# EAGLE design Sensor_EV76C560 (EAGLE 9.6.2)
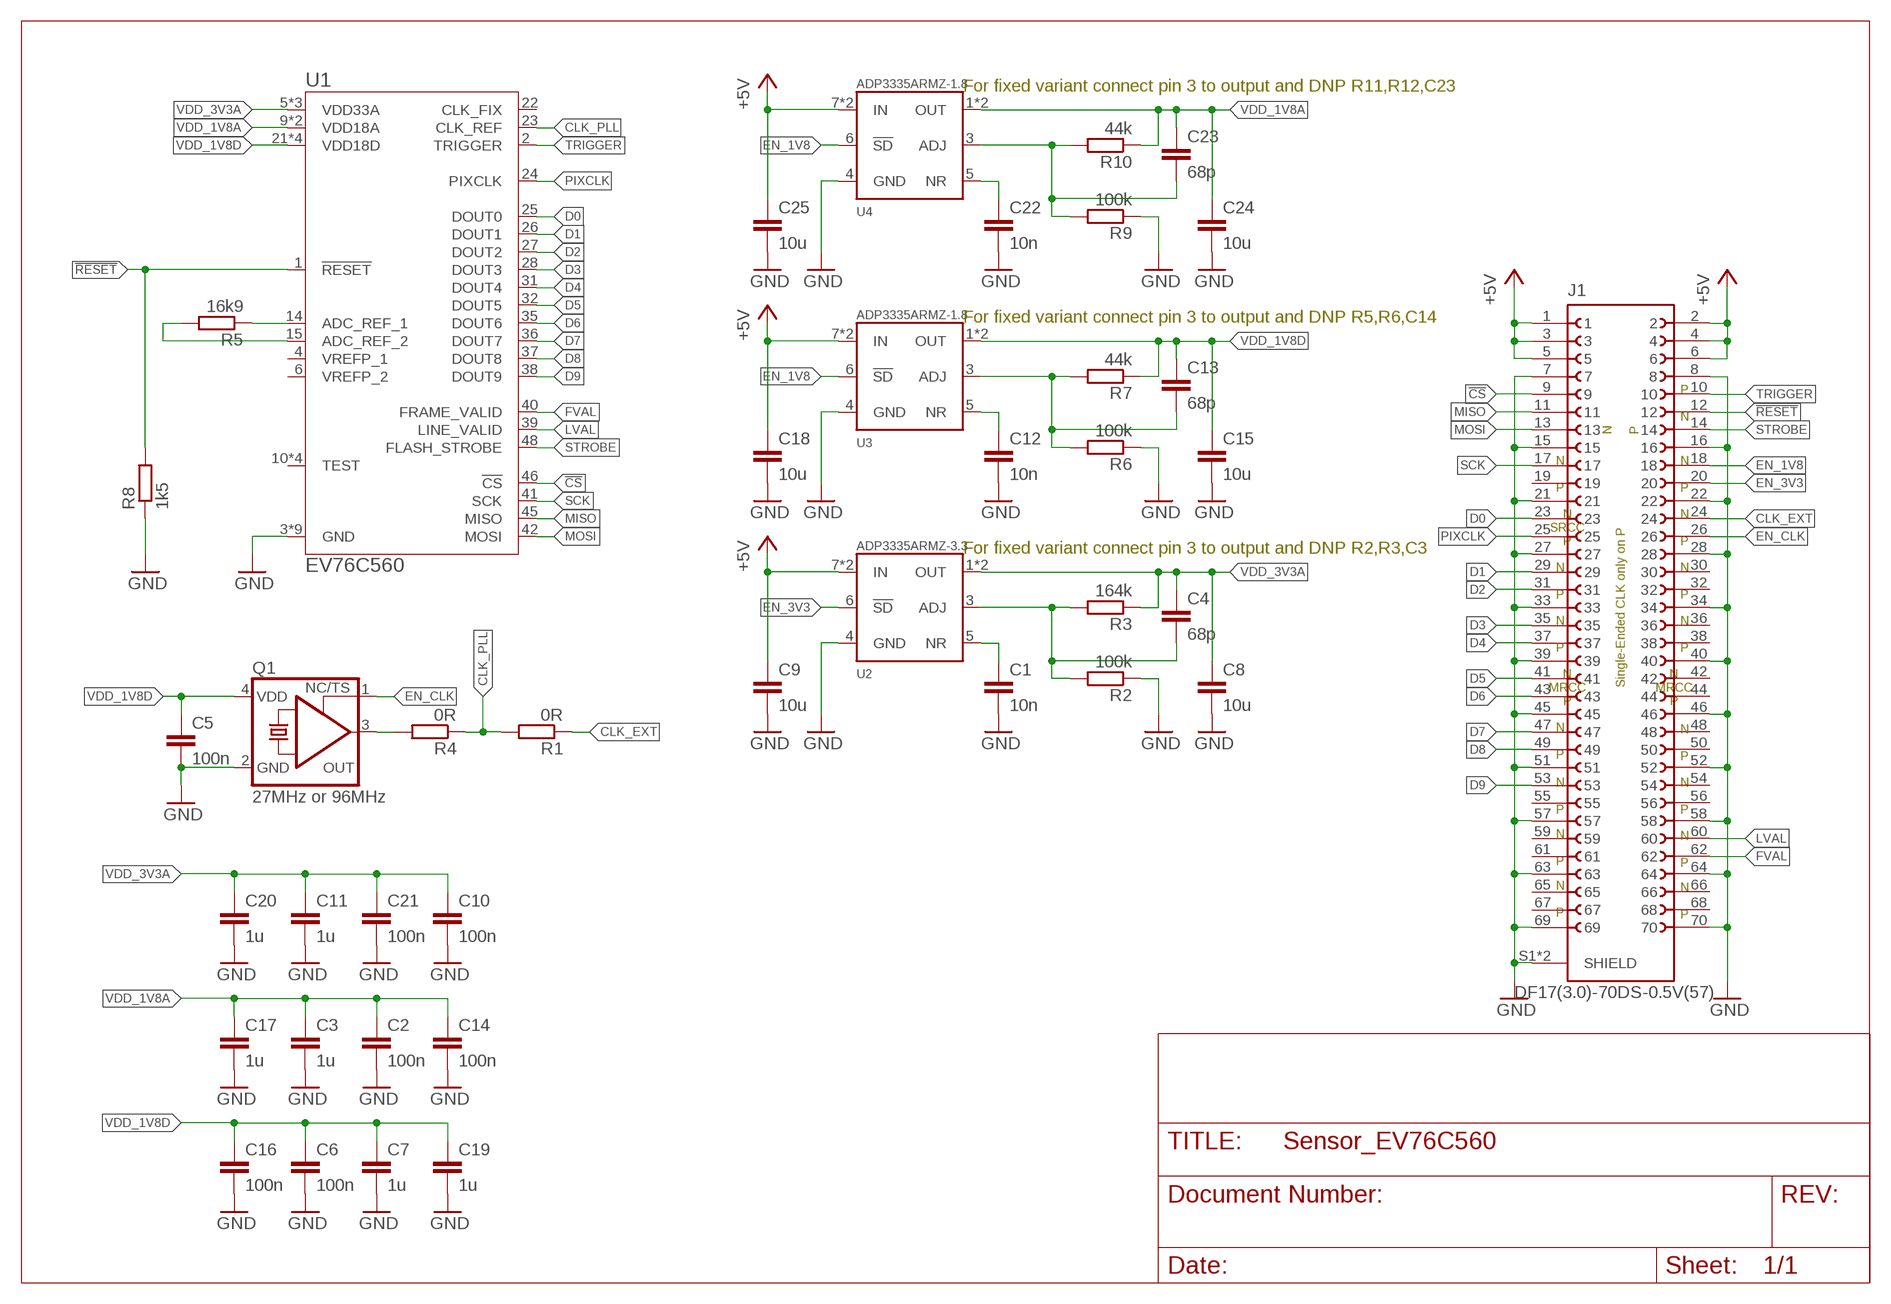
[diagram p0: schematic, sheet 1]

## Parts
C1  10n  C-EUC0402  [C0402]
C2  100n  C-EUC0402  [C0402]
C3  1u  C-EUC0402  [C0402]
C4  68p  C-EUC0402  [C0402]
C5  100n  C-EUC0402  [C0402]
C6  100n  C-EUC0402  [C0402]
C7  1u  C-EUC0402  [C0402]
C8  10u  C-EUC0603  [C0603]
C9  10u  C-EUC0603  [C0603]
C10  100n  C-EUC0402  [C0402]
C11  1u  C-EUC0402  [C0402]
C12  10n  C-EUC0402  [C0402]
C13  68p  C-EUC0402  [C0402]
C14  100n  C-EUC0402  [C0402]
C15  10u  C-EUC0603  [C0603]
C16  100n  C-EUC0402  [C0402]
C17  1u  C-EUC0402  [C0402]
C18  10u  C-EUC0603  [C0603]
C19  1u  C-EUC0402  [C0402]
C20  1u  C-EUC0402  [C0402]
C21  100n  C-EUC0402  [C0402]
C22  10n  C-EUC0402  [C0402]
C23  68p  C-EUC0402  [C0402]
C24  10u  C-EUC0603  [C0603]
C25  10u  C-EUC0603  [C0603]
J1  DF17(3.0)-70DS-0.5V(57)  [DF17(3.0)-70DS-0.5V(57)]
Q1  27MHz or 96MHz  KXO-PXO/XO-V96  [3.2X2.5_KXO-V96]
R1  0R  R-EU_R0402  [R0402]
R2  100k  R-EU_R0402  [R0402]
R3  164k  R-EU_R0402  [R0402]
R4  0R  R-EU_R0402  [R0402]
R5  16k9  R-EU_R0402  [R0402]
R6  100k  R-EU_R0402  [R0402]
R7  44k  R-EU_R0402  [R0402]
R8  1k5  R-EU_R0402  [R0402]
R9  100k  R-EU_R0402  [R0402]
R10  44k  R-EU_R0402  [R0402]
U1  EV76C560  [LCC-48]
U2  ADP3335ARMZ-3.3  NCP3335  [MSOP08]
U3  ADP3335ARMZ-1.8  NCP3335  [MSOP08]
U4  ADP3335ARMZ-1.8  NCP3335  [MSOP08]

## Nets
!CS: J1.9 U1.46(!CS)
!RESET: J1.12 R8.2 U1.1(!RESET)
+5V: C9.1 C18.1 C25.1 J1.1 J1.2 J1.3 J1.4 J1.5 J1.6 U2.7(IN) U2.8(IN) U3.7(IN) U3.8(IN) U4.7(IN) U4.8(IN)
CLK: Q1.3(OUT) R4.2
CLK_EXT: J1.24 R1.1
CLK_PLL: R1.2 R4.1 U1.23(CLK_REF)
D0: J1.23 U1.25(DOUT0)
D1: J1.29 U1.26(DOUT1)
D2: J1.31 U1.27(DOUT2)
D3: J1.35 U1.28(DOUT3)
D4: J1.37 U1.31(DOUT4)
D5: J1.41 U1.32(DOUT5)
D6: J1.43 U1.35(DOUT6)
D7: J1.47 U1.36(DOUT7)
D8: J1.49 U1.37(DOUT8)
D9: J1.53 U1.38(DOUT9)
EN_1V8: J1.18 U3.6(!SD) U4.6(!SD)
EN_3V3: J1.20 U2.6(!SD)
EN_CLK: J1.26 Q1.1(TS)
FVAL: J1.62 U1.40(FRAME_VALID)
GND: C1.2 C2.2 C3.2 C5.2 C6.2 C7.2 C8.2 C9.2 C10.2 C11.2 C12.2 C14.2 C15.2 C16.2 C17.2 C18.2 C19.2 C20.2 C21.2 C22.2 C24.2 C25.2 J1.7 J1.8 J1.15 J1.16 J1.21 J1.22 J1.27 J1.28 J1.33 J1.34 J1.39 J1.40 J1.45 J1.46 J1.51 J1.52 J1.57 J1.58 J1.63 J1.64 J1.69 J1.70 J1.S1(SHIELD) J1.S2(SHIELD) Q1.2(GND) R2.1 R6.1 R8.1 R9.1 U1.3(GND) U1.7(GND) U1.13(GND) U1.16(GND) U1.19(GND) U1.20(GND) U1.29(GND) U1.33(GND) U1.43(GND) U2.4(GND) U3.4(GND) U4.4(GND)
LVAL: J1.60 U1.39(LINE_VALID)
MISO: J1.11 U1.45(MISO)
MOSI: J1.13 U1.42(MOSI)
N$00002: C1.1 U2.5(NR)
N$00003: C22.1 U4.5(NR)
N$00004: C12.1 U3.5(NR)
N$00005: C23.2 R9.2 R10.2 U4.3(ADJ)
N$00006: C13.2 R6.2 R7.2 U3.3(ADJ)
N$00007: R5.1 U1.14(ADC_REF_1)
N$00008: R5.2 U1.15(ADC_REF_2)
N$00010: C4.2 R2.2 R3.2 U2.3(ADJ)
PIXCLK: J1.25 U1.24(PIXCLK)
SCK: J1.17 U1.41(SCK)
STROBE: J1.14 U1.48(FLASH_STROBE)
TRIGGER: J1.10 U1.2(TRIGGER)
VDD_1V8A: C2.1 C3.1 C14.1 C17.1 C23.1 C24.1 R10.1 U1.9(VDD18A) U1.18(VDD18A) U4.1(OUT) U4.2(OUT)
VDD_1V8D: C5.1 C6.1 C7.1 C13.1 C15.1 C16.1 C19.1 Q1.4(VDD) R7.1 U1.21(VDD18D) U1.30(VDD18D) U1.34(VDD18D) U1.44(VDD18D) U3.1(OUT) U3.2(OUT)
VDD_3V3A: C4.1 C8.1 C10.1 C11.1 C20.1 C21.1 R3.1 U1.5(VDD33A) U1.8(VDD33A) U1.17(VDD33A) U2.1(OUT) U2.2(OUT)
Unconnected: J1.19 J1.30 J1.32 J1.36 J1.38 J1.42 J1.44 J1.48 J1.50 J1.54 J1.55 J1.56 J1.59 J1.61 J1.65 J1.66 J1.67 J1.68 U1.4(VREFP_1) U1.6(VREFP_2) U1.10(TEST) U1.11(TEST) U1.12(TEST) U1.22(CLK_FIX) U1.47(TEST)

## Notes on the sheet
- For fixed variant connect pin 3 to output and DNP R11,R12,C23
- For fixed variant connect pin 3 to output and DNP R5,R6,C14
- P
   
  N
- N
   
  P
- N
   
  P
- N
   
  P
- N
  SRCC
  P
- N
   
  P
- For fixed variant connect pin 3 to output and DNP R2,R3,C3
- N
   
  P
- N
   
  P
- Single-Ended CLK only on P
- N
   
  P
- N
   
  P
- N
  MRCC
  P
- N
  MRCC
  P
- N
   
  P
- N
   
  P
- N
   
  P
- N
   
  P
- N
   
  P
- N
   
  P
- N
   
  P
- N
   
  P

## Library data of the parts
C1 C2 C4 C6 C10 C12-C14 C16 C21-C23 = rcl:C-EU: CAPACITOR, European symbol; LCSC: C1525; SPICEPREFIX: C
C3 C7-C9 C11 C15 C17-C20 C24 C25 = rcl:C-EU: CAPACITOR, European symbol; SPICEPREFIX: C
C5 = rcl:C-EU: CAPACITOR, European symbol; LCSC: C1525
J1 = Hirose:DF17(3.0)-70DS-0.5V(57)
Q1 = crystal-geyer_V1_0:KXO-PXO/XO-V: Clock Oscillator (PXO/XO) MHz : KXO-V - Serie Model Size l/w/h [mm] Frequency Range Frequency Stability Temp. Range [°C] Output AECQ 200 availabel Datasheet KXO-V94 KXO-V94 KXO-V95 KXO-V95 KXO-V96 KXO-V96 KXO-V99 KXO-V99 KXO-97 KXO-V97 KXO-97 - KXO-V97 2.0/1.6/0.80 2.0/1.6/0.80 2.5/2.0/0.82 2.5/2.0/0.82 3.2/2.5/1.2 3.2/2.5/1.2 5.0/3.2/1.2 5.0/3.2/1.2 7.0/5.08/1.3 7.0/5.08/1.3 7.0/5.08/1.3 32,768 kHz 1,0 ~ 80,0 MHz 32,768 kHz 1,0 ~ 70,0 MHz 32,768 kHz 1,0 ~ 156,0 MHz 32,768 kHz 1,0 ~ 200,0 MHz 32,768 kHz 32,768 kHz 1,0 ~ 160,0 MHz ±25 … ±100ppm ±25 … ±100ppm ±25 … ±100ppm ±25 … ±100ppm ±25 … ±100ppm ±25 … ±100ppm ±25 … ±100ppm ±25 … ±100ppm ±25 … ±100ppm ±25 … ±100ppm ±25 … ±100ppm (*) -40°C …+85°C (*) -40°C …+85°C (*) -40°C …+85°C (*) -40°C …+85°C (*) -40°C …+85°C (*) -40°C …+85°C (*) -40°C …+85°C (*) -40°C …+85°C (*) -40°C …+85°C (*) -40°C …+85°C (*) -40°C …+85°C HCMOS HCMOS HCMOS HCMOS HCMOS HCMOS HCMOS HCMOS HCMOS HCMOS HCMOS - - yes yes yes yes - - - - - KXO-V94-kHz.pdf <http://www.geyer-electronic.de/uploads/tx_userartikelfrequenz/GEYER-KXO-V94-kHz.pdf> KXO-V94.pdf <http://www.geyer-electronic.de/uploads/tx_userartikelfrequenz/GEYER-KXO-V94.pdf> KXO-V95-kHz.pdf <http://www.geyer-electronic.de/uploads/tx_userartikelfrequenz/GEYER-KXO-V95-kHz.pdf> KXO-V95.pdf <http://www.geyer-electronic.de/uploads/tx_userartikelfrequenz/GEYER-KXO-V95.pdf> KXO-V96-kHz.pdf <http://www.geyer-electronic.de/uploads/tx_userartikelfrequenz/GEYER-KXO-V96-kHz.pdf> KXO-V96.pdf <http://www.geyer-electronic.de/uploads/tx_userartikelfrequenz/GEYER-KXO-V96.pdf> KXO-V99-kHz.pdf <http://www.geyer-electronic.de/uploads/tx_userartikelfrequenz/GEYER-KXO-V99-kHz.pdf> KXO-V99.pdf <http://www.geyer-electronic.de/uploads/tx_userartikelfrequenz/GEYER-KXO-V99.pdf> KXO-97-kHz.pdf <http://www.geyer-electronic.de/uploads/tx_userartikelfrequenz/GEYER-KXO-97-kHz.pdf> KXO-V97-kHz.pdf <http://www.geyer-electronic.de/uploads/tx_userartikelfrequenz/GEYER-KXO-V97-kHz.pdf> KXO-V97.pdf <http://www.geyer-electronic.de/uploads/tx_userartikelfrequenz/GEYER-KXO-V97.pdf> <http://www.geyer-electronic.de/fileadmin/template/img/logo-geyer-electronic.png> Details see: http://www.geyer-electronic.de/Frequenz-Produkte.9.0.html Created 2016-06-07, Hans Locher 2016 (C) Geyer Quartz Technology Hans Locher KXOV94,KXOV95;KXOV96;KXOV97;KXO97;2016;2520;3225;5032;70508;2,5x2,0;3,2x2,5;5,0x3,2;7,0x5,08;2.5x2.0;3.2x2.5;5.0x3.2;7.0x5.08;
R1-R10 = rcl:R-EU_: RESISTOR, European symbol; SPICEPREFIX: R
U1 = onsemi:EV76C560: e2V EV76C560 1.3MP CMOS Image Sensor
U2 = analog_devices:NCP3335: NCP3335 Low Dropout Regulator - Ultra High Accuracy, Low Iq, 500 mA; DIGIKEY: 505-ADP3335ARMZ-3.3RL7CT-ND
U3 = analog_devices:NCP3335: NCP3335 Low Dropout Regulator - Ultra High Accuracy, Low Iq, 500 mA; DIGIKEY: 505-ADP3335ARMZ-2.5-RLCT-ND
U4 = analog_devices:NCP3335: NCP3335 Low Dropout Regulator - Ultra High Accuracy, Low Iq, 500 mA; DIGIKEY: 505-ADP3335ARMZ-1.8-R7CT-ND

## Board
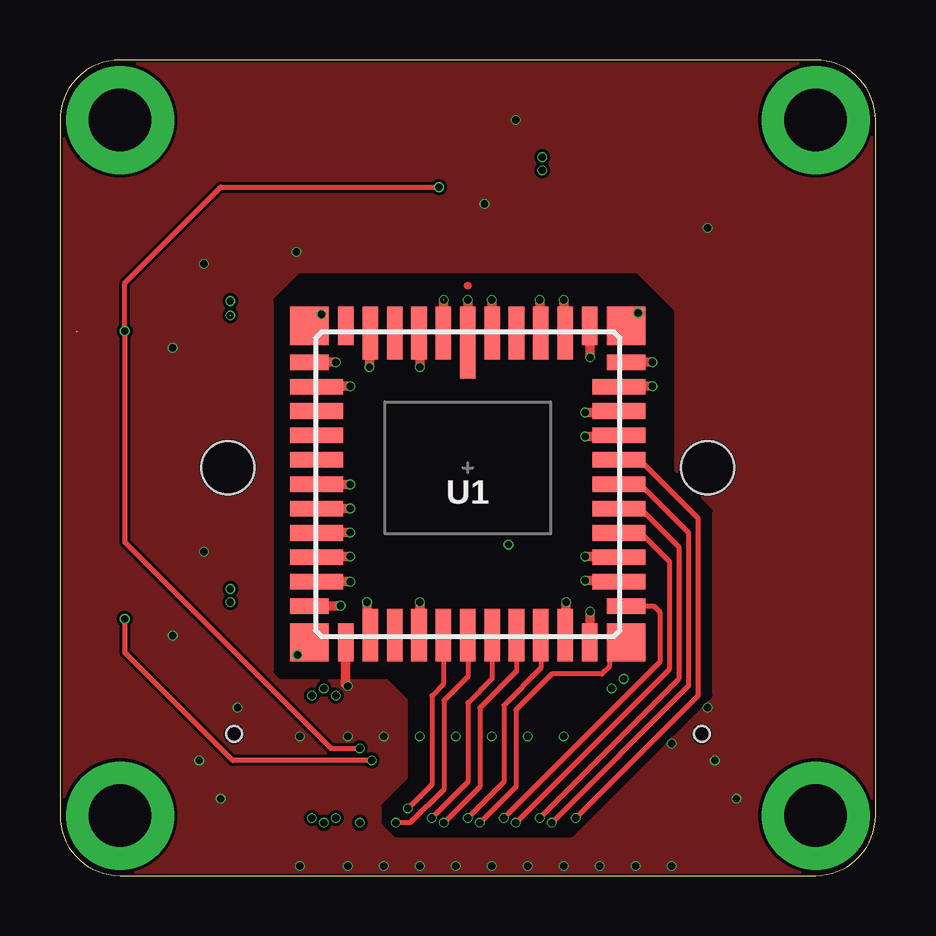
[diagram p1: board, top side]
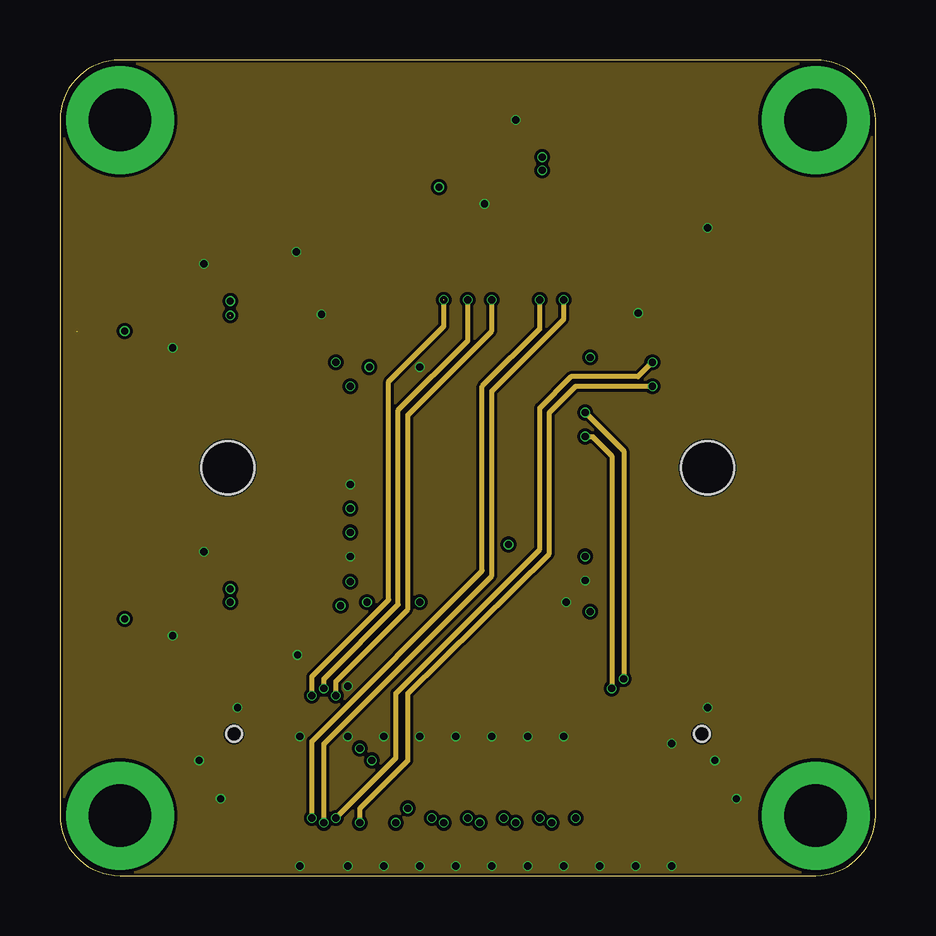
[diagram p2: board, inner layer Route2]
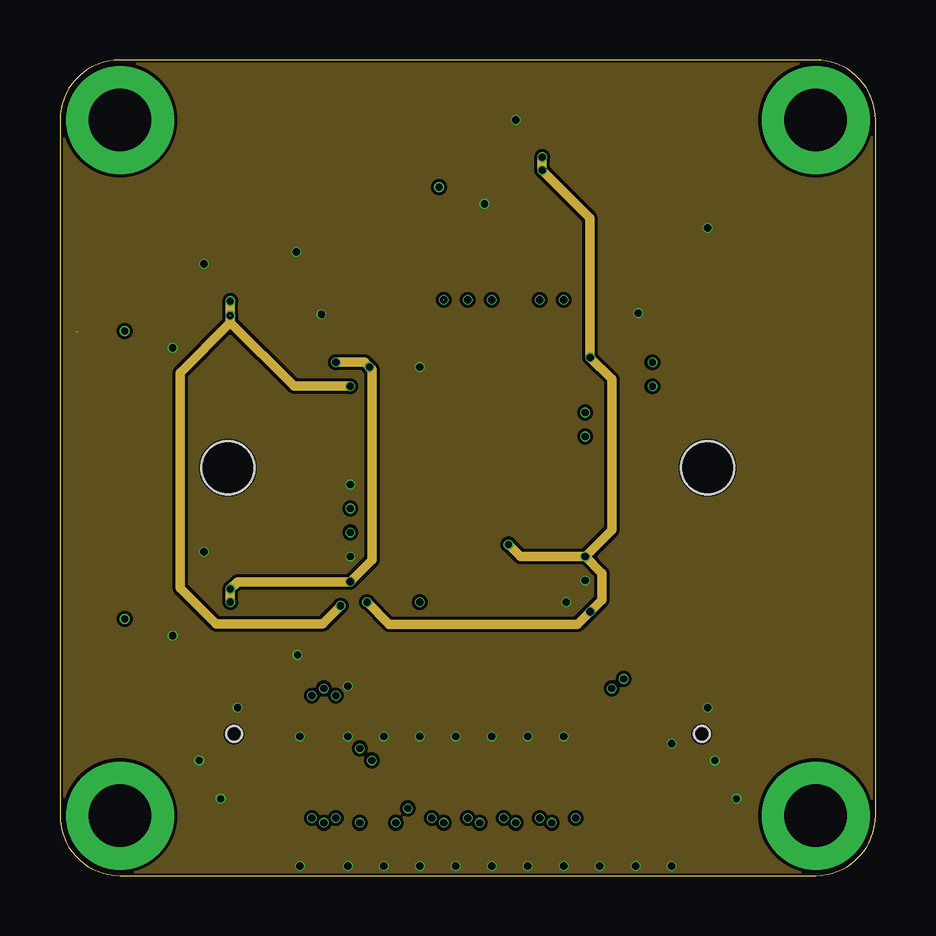
[diagram p3: board, inner layer Route15]
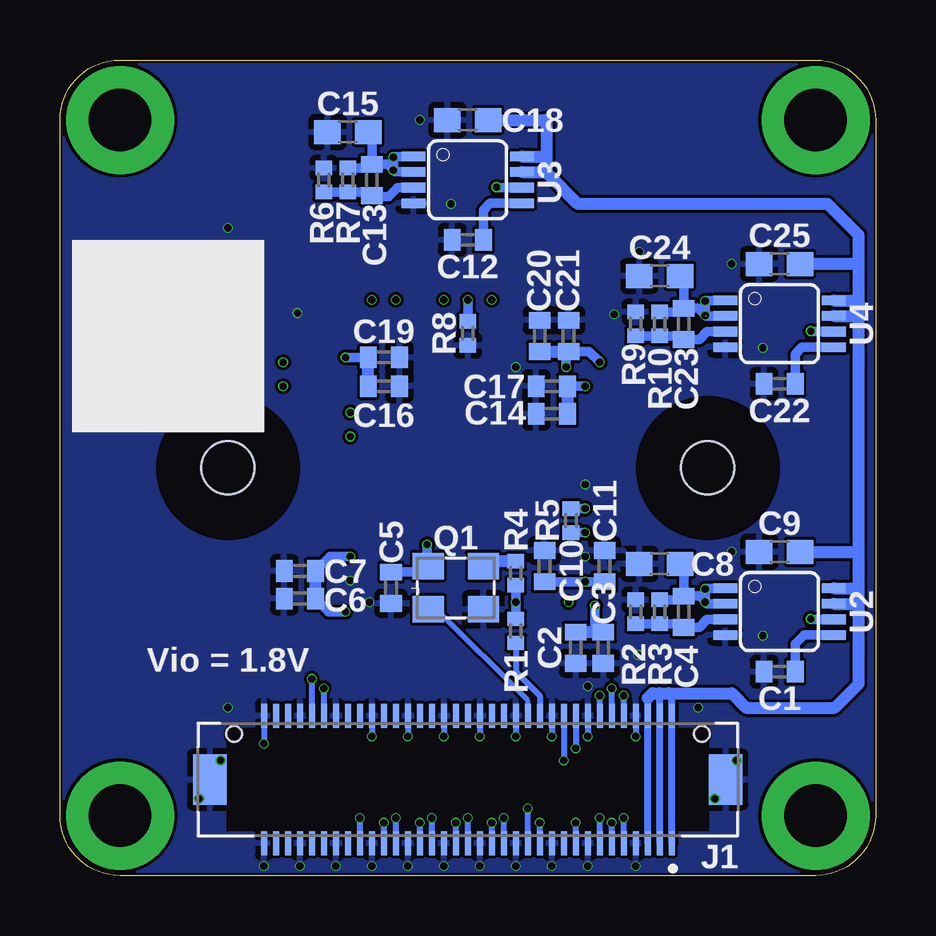
[diagram p4: board, bottom side, seen from below]

Size 34 x 34 mm. Coordinates in mm from the lower left corner, seen from the top.
Outline: 0,31.5 0,2.5 arc90 2.5,0 31.5,0 arc90 34,2.5 34,31.5 arc90 31.5,34 2.5,34 arc90 0,31.5
Copper layers (1*2*15*16): Top 0.035559375mm / dielectric 0.17018125mm / Route2 0.01778125mm / dielectric 47mil / Route15 0.01778125mm / dielectric 0.17018125mm / Bottom 0.035559375mm
Design rules "jlcpcb-4-layer *": minimum track width 5mil, minimum drill 0.2mm, track to track 5mil, track to pad 5mil, pad to pad 5mil, via to via 5mil, smd to smd 0mil, copper to edge 0.1mm, drill to drill 5mil, minimum pad ring 0.1mm, minimum via ring 0.05mm, stop-mask expansion 3mil, vias tented up to drill 100mil, thermal gap 10mil
Holes 2.2 mm at 27,17 7,17
bRestrict: area 4.2,14.2 to 9.8,19.8; area 24.2,14.2 to 29.8,19.8

### Footprints (pad centres in the part's own frame; a part is rotated, then mirrored left to right if it is on the bottom)
C0402 = smd 0.7 x 0.9: 1 -0.65,0; 2 0.65,0
C0603 = smd 1.1 x 1: 1 -0.85,0; 2 0.85,0
DF17(3.0)-70DS-0.5V(57) = smd 0.25 x 1: 1 -8.5,2.65; 2 -8.5,-2.65; 3 -8,2.65; 4 -8,-2.65; 5 -7.5,2.65; 6 -7.5,-2.65; 7 -7,2.65; 8 -7,-2.65; 9 -6.5,2.65; 10 -6.5,-2.65; 11 -6,2.65; 12 -6,-2.65; 13 -5.5,2.65; 14 -5.5,-2.65; 15 -5,2.65; 16 -5,-2.65; 17 -4.5,2.65; 18 -4.5,-2.65; 19 -4,2.65; 20 -4,-2.65; 21 -3.5,2.65; 22 -3.5,-2.65; 23 -3,2.65; 24 -3,-2.65; 25 -2.5,2.65; 26 -2.5,-2.65; 27 -2,2.65; 28 -2,-2.65; 29 -1.5,2.65; 30 -1.5,-2.65; 31 -1,2.65; 32 -1,-2.65; 33 -0.5,2.65; 34 -0.5,-2.65; 35 0,2.65; 36 0,-2.65; 37 0.5,2.65; 38 0.5,-2.65; 39 1,2.65; 40 1,-2.65; 41 1.5,2.65; 42 1.5,-2.65; 43 2,2.65; 44 2,-2.65; 45 2.5,2.65; 46 2.5,-2.65; 47 3,2.65; 48 3,-2.65; 49 3.5,2.65; 50 3.5,-2.65; 51 4,2.65; 52 4,-2.65; 53 4.5,2.65; 54 4.5,-2.65; 55 5,2.65; 56 5,-2.65; 57 5.5,2.65; 58 5.5,-2.65; 59 6,2.65; 60 6,-2.65; 61 6.5,2.65; 62 6.5,-2.65; 63 7,2.65; 64 7,-2.65; 65 7.5,2.65; 66 7.5,-2.65; 67 8,2.65; 68 8,-2.65; 69 8.5,2.65; 70 8.5,-2.65 | smd 1.4 x 2.1: S1 -10.75,0; S2 10.75,0 | hole 0.65: -9.75,-1.9; 9.75,-1.9
3.2X2.5_KXO-V96 = smd 1.3 x 1.1: 1 -1.15,-0.9; 2 1.15,-0.9; 3 1.15,0.9; 4 -1.15,0.9
R0402 = smd 0.6 x 0.7: 1 -0.5,0; 2 0.5,0
LCC-48 = smd 0.65 x 3: 1 0,5.215 | smd 0.65 x 2.2: 2 -1.016,5.611; 3 -2.032,5.611; 4 -3.048,5.611; 5 -4.064,5.611; 21 -4.064,-6.981; 22 -3.048,-6.981; 23 -2.032,-6.981; 24 -1.016,-6.981; 25 0,-6.981; 26 1.016,-6.981; 27 2.032,-6.981; 28 3.048,-6.981; 29 4.064,-6.981; 45 4.064,5.611; 46 3.048,5.611; 47 2.032,5.611; 48 1.016,5.611 | smd 0.65 x 1.6: 6 -5.08,5.911; 20 -5.08,-7.281; 30 5.08,-7.281; 44 5.08,5.911 | smd 1.6 x 1.6: 7 -6.596,5.911; 19 -6.596,-7.281; 31 6.596,-7.281; 43 6.596,5.911 | smd 1.6 x 0.65: 8 -6.596,4.395; 18 -6.596,-5.765; 32 6.596,-5.765; 42 6.596,4.395 | smd 2.2 x 0.65: 9 -6.296,3.379; 10 -6.296,2.363; 11 -6.296,1.347; 12 -6.296,0.331; 13 -6.296,-0.685; 14 -6.296,-1.701; 15 -6.296,-2.717; 16 -6.296,-3.733; 17 -6.296,-4.749; 33 6.296,-4.749; 34 6.296,-3.733; 35 6.296,-2.717; 36 6.296,-1.701; 37 6.296,-0.685; 38 6.296,0.331; 39 6.296,1.347; 40 6.296,2.363; 41 6.296,3.379
MSOP08 = smd 0.4 x 1: 1 -0.976,-2.263; 2 -0.326,-2.263; 3 0.324,-2.263; 4 0.974,-2.263; 5 0.974,2.262; 6 0.324,2.262; 7 -0.326,2.262; 8 -0.976,2.262

### Placement (x,y rotation side)
C1  4,8.5 180 bottom
C2  12.5,9.5 270 bottom
C3  11.35,9.5 270 bottom
C4  8,11 270 bottom
C5  20.2,12 270 bottom
C6  24,11.55 180 bottom
C7  24,12.7 180 bottom
C8  9,13 180 bottom
C9  4,13.5 180 bottom
C10  13.8,12.9 90 bottom
C11  11.3,12.9 90 bottom
C12  17,26.5 180 bottom
C13  21,29 270 bottom
C14  13.5,19.25 180 bottom
C15  22,31 180 bottom
C16  20.5,20.4 0 bottom
C17  13.5,20.4 180 bottom
C18  17,31.5 180 bottom
C19  20.5,21.6 0 bottom
C20  14,22.5 90 bottom
C21  12.8,22.5 90 bottom
C22  4,20.5 180 bottom
C23  8,23 270 bottom
C24  9,25 180 bottom
C25  4,25.5 180 bottom
J1  17,4 180 bottom
Q1  17.5,12 0 bottom
R1  15,10.2 90 bottom
R2  10,11 270 bottom
R3  9,11 270 bottom
R4  15,12.6 90 bottom
R5  12.7,14.8 270 bottom
R6  23,29 270 bottom
R7  22,29 270 bottom
R8  17,22.6 90 bottom
R9  10,23 270 bottom
R10  9,23 270 bottom
U1  17,17 0 top
U2  4,11 270 bottom
U3  17,29 270 bottom
U4  4,23 270 bottom

### Tracks (layer width: path | path; a pad name or v marks a point on that pad's centre or on a via)
!CS  (via drill 0.3)
  Top 0.4: U1.46 20,22.66 v20,24
  Route2 0.2: v10.5,2.4 10.5,5.6 17.6,12.7 17.6,20.4 20,22.8 v20,24
  Bottom 0.25: J1.9 v10.5,2.4
!RESET  (via drill 0.3)
  Top 0.4: U1.1 v17,24
  Route2 0.2: v11,7.8 11,8.2 14.1,11.3 14.1,19.4 17,22.3 v17,24
  Bottom 0.25: J1.12 v11,7.8
  Bottom 0.4: v17,24 R8.2
+5V  (1 unrouted)
  Bottom 0.3: J1.1 J1.2 8.5,7.5 8.6,7.6 | J1.3 J1.4 9,7.6 | J1.5 J1.6 9.5,7.4
  Bottom 0.5: 9.5,7.4 9.3,7.6 9,7.6 8.6,7.6 6,7.6 5.4,7 1.7,7 0.7,8 0.7,11.4 | 0.7,25.5 C25.1 | 0.7,11.4 0.7,12 | 0.7,12 0.7,13.5 | 13.7,29.3 13.7,30 | 13.7,30 13.7,31.4 13.8,31.5 C18.1 | 0.7,22.7 0.7,23.4 | 0.7,23.4 0.7,23.9 | 0.7,23.9 0.7,25.5 | U2.8 0.72,11.98 0.7,12 | U2.7 0.77,11.33 0.7,11.4 | C9.1 0.7,13.5 | U3.7 13.73,29.33 13.7,29.3 | U3.8 13.72,29.98 13.7,30 | U4.7 0.77,23.33 0.7,23.4 | U4.8 0.78,23.98 0.7,23.9 | 0.7,13.5 0.7,22.65 | 0.7,25.5 0.7,26.7 2,28 12.4,28 13.7,29.3
CLK
  Bottom 0.5: R4.2 16.15,13.1 Q1.3
CLK_EXT
  Bottom 0.25: R1.1 15,8.5 14,7.5 J1.24
CLK_PLL  (via drill 0.3)
  Top 0.4: v15,11.4 15,10.05 U1.23
  Bottom 0.4: R1.2 v15,11.4 R4.1
D0  (via drill 0.3)
  Top 0.2: U1.25 17,8.3 16,7.3 16,3.6 14.6,2.2 v14,2.2
  Bottom 0.25: J1.23 v14,2.2
D1  (via drill 0.3)
  Top 0.2: U1.26 18.02,8.22 17,7.2 17,3.9 v15.5,2.4
  Bottom 0.25: J1.29 v15.5,2.4
D2  (via drill 0.3)
  Top 0.2: U1.27 19.03,8.53 17.5,7 17.5,3.7 v16,2.2
  Bottom 0.25: J1.31 v16,2.2
D3  (via drill 0.3)
  Top 0.2: U1.28 20.05,8.65 18.5,7.1 18.5,3.9 v17,2.4
  Bottom 0.25: J1.35 v17,2.4
D4  (via drill 0.3)
  Top 0.2: U1.31 22.9,9.02 22.9,8.7 22.6,8.4 20.5,8.4 19,6.9 19,3.7 v17.5,2.2
  Bottom 0.25: J1.37 v17.5,2.2
D5  (via drill 0.3)
  Top 0.2: U1.32 24.77,11.23 25,11 25,8.9 v18.5,2.4
  Bottom 0.25: J1.41 v18.5,2.4
D6  (via drill 0.3)
  Top 0.2: U1.35 24.22,14.28 25.4,13.1 25.4,8.6 v19,2.2
  Bottom 0.25: J1.43 v19,2.2
D7  (via drill 0.3)
  Top 0.2: U1.36 24.2,15.3 25.8,13.7 25.8,8.2 v20,2.4
  Bottom 0.25: J1.47 v20,2.4
D8  (via drill 0.3)
  Top 0.2: U1.37 24.18,16.32 26.2,14.3 26.2,7.9 v20.5,2.2
  Bottom 0.25: J1.49 v20.5,2.2
D9  (via drill 0.3)
  Top 0.2: U1.38 24.17,17.33 26.6,14.9 26.6,7.5 v21.5,2.4
  Bottom 0.25: J1.53 v21.5,2.4
EN_1V8  (via drill 0.3)
  Top 0.2: v15.8,28.7 6.7,28.7 2.7,24.7 v2.7,22.7 2.7,13.9 11.3,5.3 v12.5,5.3
  Bottom 0.25: J1.18 v12.5,5.3
  Bottom 0.4: U4.6 2.68,22.68 v2.7,22.7 | U3.6 15.78,28.68 v15.8,28.7
EN_3V3  (via drill 0.3)
  Top 0.2: v2.7,10.7 2.7,9.3 7.2,4.8 v13,4.8
  Bottom 0.25: J1.20 v13,4.8
  Bottom 0.4: U2.6 2.68,10.68 v2.7,10.7
EN_CLK
  Bottom 0.2: J1.26 14.5,7.3 18.3,11.1 Q1.1
FVAL  (via drill 0.3)
  Top 0.4: U1.40 23.23,19.3 v21.9,19.3
  Route2 0.2: v21.9,19.3 23.5,17.7 v23.5,8.2
  Bottom 0.25: J1.62 v23.5,8.2
GND  (via drill 0.3)
  Top 0.4: U1.3 15,22.58 v15,21.2 | U1.13 10.72,16.3 v12.1,16.3 | U1.16 10.74,13.3 v12.1,13.3 | U1.29 21.1,10.05 v21.1,11.4 | U1.33 23.25,12.3 v21.9,12.3 | v12,7.9 11.9,8 11.9,9.8 U1.20 | U1.19 10.4,9.7 v9.9,9.2 | U1.43 23.6,22.95 v24.1,23.45 | v10.9,23.4 U1.7
  Bottom 0.25: J1.40 v18,5.8 | J1.46 v19.5,5.8 | J1.52 v21,5.8 | J1.34 v16.5,5.8 | J1.28 v15,5.8 | J1.22 v13.5,5.8 | J1.70 v25.5,5.5 | J1.16 v12,5.8 | J1.8 v10,5.8
  other vias: 15,0.4 16.5,0.4 18,0.4 19.5,0.4 21,0.4 22.5,0.4 24,0.4 5.8,4.8 6.7,3.2 27.3,4.8 28.2,3.2 13.5,0.4 12,0.4 10,0.4 25.5,0.4 17.7,28 4.7,22 4.7,10 7.4,7 6,13.5 19,31.5 6,25.5 9.85,26 27,27 27,7
  pour Top: 0,0 34,0 34,34 0,34
  pour Bottom: 0,0 34,0 34,34 0,34
  pour Route15 (rank 2): 0,0 34,0 34,34 0,34
  pour Route2: 0,0 34,0 34,34 0,34
  cutout Top: 14,1.7 21.3,1.7 27.1,7.5 27.1,15.2 25.5,16.8 25.5,23.5 24,25 10,25 9,24 9,8.5 9.2,8.3 13.7,8.3 14.6,7.4 14.6,4 13.5,2.9 13.5,2.2
LVAL  (via drill 0.3)
  Top 0.4: U1.39 23.25,18.3 v21.9,18.3
  Route2 0.2: v21.9,18.3 22.2,18.3 23,17.5 v23,7.8
  Bottom 0.25: J1.60 v23,7.8
MISO  (via drill 0.3)
  Top 0.4: U1.45 21,22.68 v21,24
  Route2 0.2: v11,2.2 11,5.5 18,12.5 18,20.2 21,23.2 v21,24
  Bottom 0.25: J1.11 v11,2.2
MOSI  (via drill 0.3)
  Top 0.4: U1.42 23.5,21.4 v24.7,21.4
  Route2 0.2: v11.5,2.4 14,4.9 14,7.6 20,13.6 20,19.5 21.3,20.8 24.1,20.8 v24.7,21.4
  Bottom 0.25: J1.13 v11.5,2.4
N$00001  (via drill 2.6 pad 4.5)
  other vias: 31.5,31.5
N$00002
  Bottom 0.4: U2.5 2.97,10.03 3.35,9.65 C1.1
N$00003
  Bottom 0.4: U4.5 3.07,22.03 3.35,21.75 C22.1
N$00004
  Bottom 0.4: U3.5 16.07,28.03 16.35,27.75 C12.1
N$00005
  Bottom 0.4: R9.2 R10.2 8.15,22.5 C23.2 7.35,22.35 7.02,22.68 U4.3
N$00006
  Bottom 0.4: U3.3 19.92,28.68 20.3,28.3 20.95,28.3 C13.2 21.15,28.5 R7.2 R6.2
N$00007  (via drill 0.3)
  Top 0.4: U1.14 v12.1,15.3
  Bottom 0.4: R5.1 v12.1,15.3
N$00008  (via drill 0.3)
  Top 0.4: v12.1,14.3 10.72,14.3 U1.15
  Bottom 0.4: R5.2 v12.1,14.3
N$00010
  Bottom 0.4: U2.3 7.02,10.68 7.35,10.35 C4.2 8.15,10.5 R3.2 R2.2
N$00025  (via drill 2.6 pad 4.5)
  other vias: 2.5,31.5
N$00027  (via drill 2.6 pad 4.5)
  other vias: 2.5,2.5
N$00028  (via drill 2.6 pad 4.5)
  other vias: 31.5,2.5
PIXCLK  (via drill 0.3)
  Top 0.2: U1.24 15.98,7.98 15.5,7.5 15.5,3.8 v14.5,2.8
  Bottom 0.25: J1.25 v14.5,2.8
SCK  (via drill 0.3)
  Top 0.4: U1.41 23.32,20.4 v24.7,20.4
  Route2 0.2: v12.5,2.2 12.5,2.8 14.5,4.8 14.5,7.6 20.4,13.41 20.4,19.3 21.5,20.4 v24.7,20.4
  Bottom 0.25: J1.17 v12.5,2.2
STROBE  (via drill 0.3)
  Top 0.4: U1.48 v18,24
  Route2 0.2: v11.5,7.5 11.5,8.1 14.5,11.1 14.5,19.2 18,22.7 v18,24
  Bottom 0.25: J1.14 v11.5,7.5
TRIGGER  (via drill 0.3)  (1 unrouted)
  Top 0.4: v15.99,24 U1.2
  Route2 0.2: v10.5,7.5 10.5,8.3 13.7,11.5 13.7,20.6 16,22.9 v16,24
  Bottom 0.25: J1.10 v10.5,7.5
VDD_1V8A  (via drill 0.3)  (1 unrouted)
  Top 0.4: U1.9 10.72,20.4 v12.1,20.4 | U1.18 10.52,11.25 v11.7,11.25
  Route15 0.4: v7.1,23.95 v7.1,23.35 7.1,23.05 | v11.7,11.25 10.95,10.5 6.5,10.5 5,12 5,20.95 7.1,23.05 | v12.1,20.4 9.75,20.4 7.1,23.05
  Bottom 0.4: U4.1 7.1,23.98 v7.1,23.95 v7.1,23.35 7.4,23.65 C23.1 | U4.2 7.07,23.33 | R10.1 8.15,23.5 C23.1 | C23.1 8,24.85 C24.1 | C17.1 v12.1,20.4 | v11.7,11.25 11.7,10.15
  Bottom 0.5: C17.1 C14.1 | C2.1 11.7,10.15 C3.1
VDD_1V8D  (via drill 0.3)
  Top 0.4: U1.21 12.8,10.16 v12.8,11.4 | U1.30 22.1,9.84 v22.1,11 | U1.34 23.26,13.3 v21.9,13.3 | U1.44 22.1,22.79 v22.1,21.6
  Route15 0.4: v20.1,29.95 v20.1,29.4 22.1,27.4 v22.1,21.6 23,20.7 23,14.4 v21.9,13.3 | v21.9,13.3 19.2,13.3 v18.7,13.8 | v12.8,11.4 13.73,10.47 21.57,10.47 v22.1,11 22.6,11.5 22.6,12.6 v21.9,13.3
  Bottom 0.4: U3.1 20.1,29.98 v20.1,29.95 v20.1,29.4 | v20.1,29.4 20.05,29.35 19.29,29.35 U3.2 | R7.1 21.15,29.5 C13.1 | v20.1,29.4 20.35,29.65 C13.1 | C13.1 21,30.85 C15.1 | C19.1 v22.1,21.6 | C6.1 22.8,11 v22.1,11 | v21.9,13.3 22.75,13.3 C7.1 | v18.7,13.8 18.7,12.95 Q1.4 18.9,12.65 C5.1
  Bottom 0.5: C6.1 C7.1 | C16.1 C19.1
VDD_3V3A  (via drill 0.3)
  Top 0.4: U1.8 10.51,21.4 v11.5,21.4 | U1.5 12.9,22.57 v12.9,21.2 | U1.17 v12.1,12.25
  Route15 0.4: v7.1,11.4 v7.1,11.95 7.4,12.25 v12.1,12.25 13,13.15 13,21.1 v12.9,21.2 12.7,21.4 v11.5,21.4
  Bottom 0.4: U2.1 7.1,11.98 v7.1,11.95 v7.1,11.4 | U2.2 7.03,11.33 v7.1,11.4 | C4.1 8.15,11.5 R3.1 | v7.1,11.4 7.35,11.65 C4.1 | C4.1 8,12.85 C8.1 | v12.9,21.2 12.9,21.75 C21.1 11.95,21.85 v11.5,21.4 | C11.1 v12.1,12.25 C10.1
  Bottom 0.5: C20.1 C21.1
(copper drawn outside any net)
  shapes: Top circle x1

### Text on the board
bNames: Vio = 1.8V
tStop: EV76C560